# EAGLE design belamini_test_B2 (EAGLE 8.7.0)

## Sheet 1 of 2

## Sheet 2 of 2
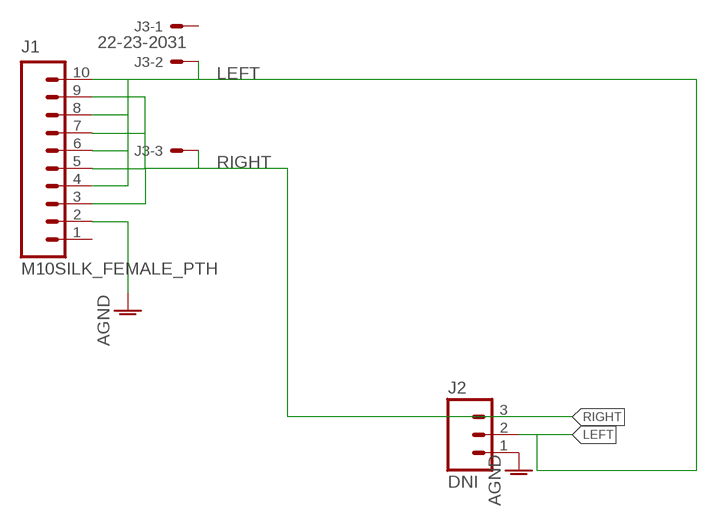
[diagram p0: schematic, sheet 2]

### Parts
J1  M10SILK_FEMALE_PTH  [1X10]
J2  DNI  M03PTH  [1X03]
J3  22-23-2031  [22-23-2031]

### Nets
AGND: J1.2
GND: J2.1 ; supply symbol labelled AGND
LEFT: J1.4 J1.6 J1.8 J1.10 J2.2 J3.2
RIGHT: J1.3 J1.5 J1.7 J1.9 J2.3 J3.3
Unconnected: J1.1 J3.1

## Library data of the parts
J1 = SparkFun-Connectors:M10: Header 10 Standard 10-pin 0.1" header. Use with straight break away headers (SKU : PRT-00116), right angle break away headers (PRT-00553), swiss pins (PRT-00743), machine pins (PRT-00117), and female headers (PRT-00115).; PROD_ID: CONN-11563
J2 = SparkFun-Connectors:M03: Header 3 Standard 3-pin 0.1" header. Use with straight break away headers (SKU : PRT-00116), right angle break away headers (PRT-00553), swiss pins (PRT-00743), machine pins (PRT-00117), and female headers (PRT-00115). Molex polarized connector foot print use with SKU : PRT-08232 with associated crimp pins and housings.
J3 = con-molex:22-23-2031: .100" (2.54mm) Center Header - 3 Pin; MF: MOLEX; MPN: 22-23-2031; OC_FARNELL: 1462950; OC_NEWARK: 30C0862

## Board
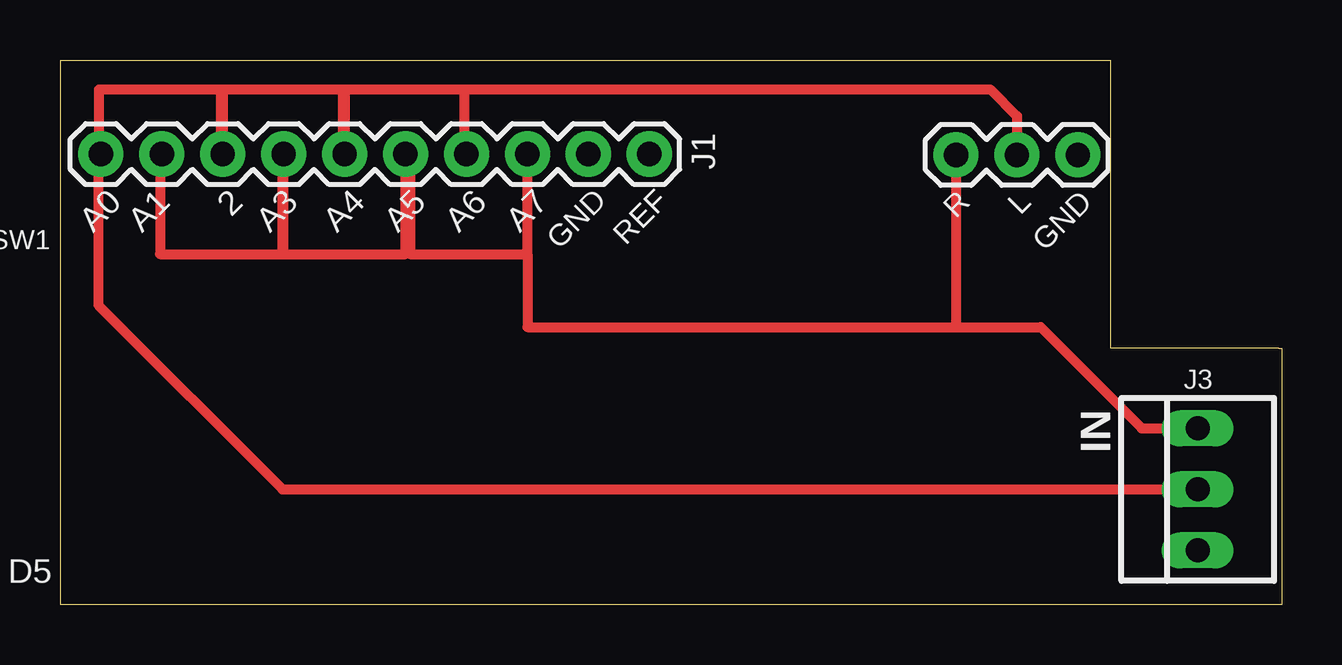
[diagram p1: board, top side]

Size 50.92 x 22.7 mm. Coordinates in mm from the lower left corner, seen from the top.
Outline: 50.8,10.69 43.79,10.69
Outline: 50.8,10.69 50.92,10.69 50.92,0
Outline: 50.92,0 0,0
Outline: 0.01,22.7 43.79,22.7
Outline: 43.79,22.69 43.79,22.69 43.79,10.69
Outline: 0.01,22.7 0,22.7 0,0
Copper layers (1*16): Top 0.035mm / dielectric 1.5mm / Bottom 0.035mm
Design rules "default *": minimum track width 8mil, minimum drill 15mil, track to track 7mil, track to pad 7mil, pad to pad 7mil, via to via 7mil, smd to smd 0mil, copper to edge 15mil, drill to drill 8mil, minimum pad ring 10mil, minimum via ring 8mil, stop-mask expansion 4mil, vias tented up to drill 20mil, thermal gap 10mil

### Footprints (pad centres in the part's own frame; a part is rotated, then mirrored left to right if it is on the bottom)
1X10 = drill 1.016 pad 1.88: 1 0,0; 2 2.54,0; 3 5.08,0; 4 7.62,0; 5 10.16,0; 6 12.7,0; 7 15.24,0; 8 17.78,0; 9 20.32,0; 10 22.86,0
1X03 = drill 1.016 pad 1.88: 1 0,0; 2 2.54,0; 3 5.08,0
22-23-2031 = drill 1 long: 1 -2.54,0; 2 0,0; 3 2.54,0

### Placement (x,y rotation side)
J1  24.56,18.78 180 top
J2  42.43,18.74 180 top
J3  47.42,4.81 90 top

### Tracks (layer width: path | path; a pad name or v marks a point on that pad's centre or on a via)
LEFT
  Top 0.406: 6.71,21.47 1.63,21.47 1.63,18.78 J1.10 1.6,18.67 1.6,12.48 9.28,4.81 J3.2 | 6.71,21.47 6.78,21.47 | 6.78,21.47 J1.8 6.71,18.78 6.71,21.47 | 6.78,21.47 11.79,21.47 | 11.79,21.47 11.86,21.47 | 11.86,21.47 J1.6 11.79,18.78 11.79,21.47 | 11.86,21.47 16.87,21.47 | J1.4 16.87,18.78 16.87,21.47 | J2.2 39.89,20.36 38.78,21.47 16.87,21.47
RIGHT
  Top 0.406: 19.48,14.61 19.48,11.56 37.43,11.56 | 19.48,14.61 J1.3 | J1.9 4.17,18.78 4.17,14.61 9.25,14.61 | 9.25,14.61 9.32,14.61 | 9.32,14.61 J1.7 9.25,18.78 9.25,14.61 | 9.32,14.61 14.4,14.61 J1.5 14.59,18.78 14.59,14.61 19.48,14.61 | 37.43,11.56 40.87,11.56 45.09,7.35 J3.3 | J2.3 37.35,11.65 37.43,11.56

### Text on the board
tPlace: A0 | A1 | 2 | A3 | A4 | A5 | A6 | A7 | GND | REF | R | L | GND | IN
tNames: SW1 | D5